# Altium schematic sheet penny.SchDoc
size A4
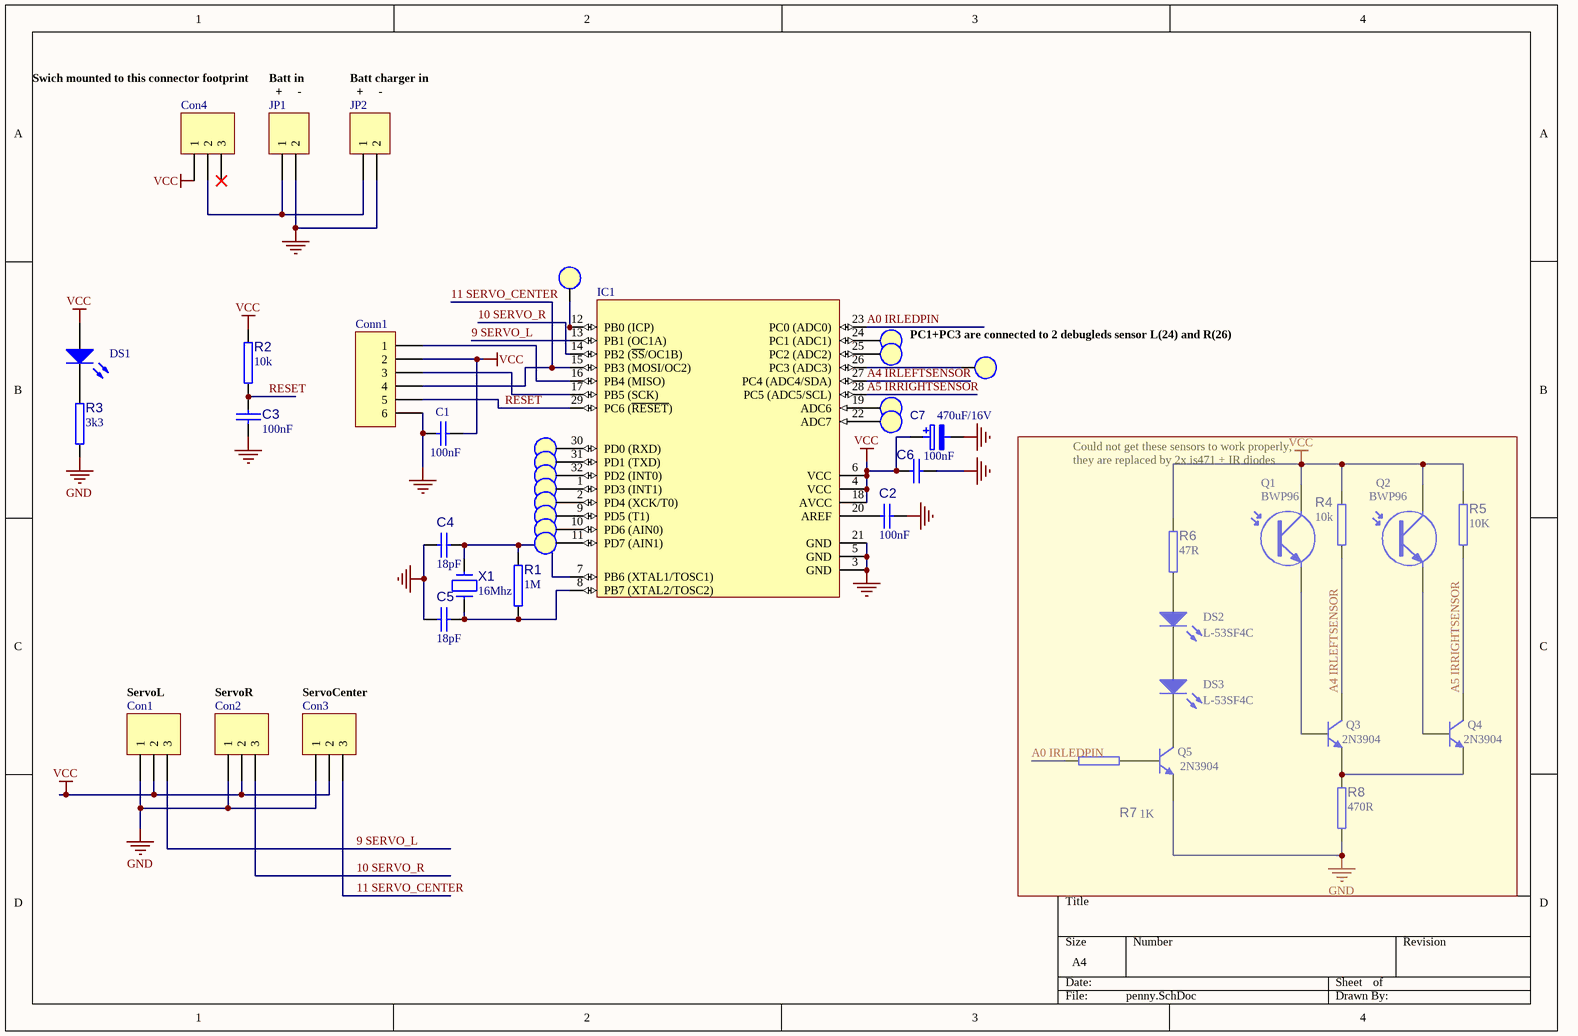
[diagram p0: penny.SchDoc]

## Parts
C1  value 100nF  [0805]
C2  value 100nF  [0805]
C3  value 100nF  [0805]
C4  value 18pF  [0805]
C5  value 18pF  [0805]
C6  value 100nF  [0805]
C7  value 470uF/16V  [RB5-10.5]
Con1  (no value)  [HDR1X3]
Con2  (no value)  [HDR1X3]
Con3  (no value)  [HDR1X3]
Con4  (no value)  [HDR1X3]
Conn1  (no value)  [HDR2X3]
DS1  (no value)  [LED-1]
DS2  value L-53SF4C  [GL480IRled]
DS3  value L-53SF4C  [GL480IRled]
IC1  (no value)  [32A]
JP1  (no value)  [HDR1X2]
JP2  (no value)  [HDR1X2]
Q1  value BWP96  [BPW96]
Q2  value BWP96  [BPW96]
Q3  value 2N3904  [BCY-W3/E4]
Q4  value 2N3904  [BCY-W3/E4]
Q5  value 2N3904  [BCY-W3/E4]
R1  value 1M  [CR2012-0805]
R2  value 10k  [0805]
R3  value 3k3  [0805]
R4  value 10k  [0805]
R5  value 10K  [0805]
R6  value 47R  [0805]
R7  value 1K  [0805]
R8  value 470R  [0805]
TP1  (no value)  [experimentpad]
TP2  (no value)  [experimentpad]
TP3  (no value)  [experimentpad]
TP4  (no value)  [experimentpad]
TP5  (no value)  [experimentpad]
TP6  (no value)  [experimentpad]
TP7  (no value)  [experimentpad]
TP8  (no value)  [experimentpad]
TP9  (no value)  [experimentpad]
TP10  (no value)  [experimentpad]
TP11  (no value)  [experimentpad]
TP12  (no value)  [experimentpad]
TP13  (no value)  [experimentpad]
TP14  (no value)  [experimentpad]
X1  value 16Mhz  [HC49/U]

## Nets
GND: C1.1 C2.2 C3.2 C4.1 C5.1 C6.2 C7.2 Con1.1 Con2.1 Con3.1 Conn1.6 IC1.3(GND) IC1.5(GND) IC1.21(GND) JP1.2 JP2.2 Q5.1(E) R3.1 R8.1
VCC: C1.2 C6.1 C7.1 Con1.2 Con2.2 Con3.2 Con4.1 Conn1.2 DS1.1(A) IC1.4(VCC) IC1.6(VCC) IC1.18(AVCC) Q1.1(C) Q2.1(C) R2.2 R4.2 R5.2 R6.2
9 SERVO_L: Con1.3 IC1.13(PB1_(OC1A))
10 SERVO_R: Con2.3 IC1.14(PB2_(~{SS}/OC1B))
11 SERVO_CENTER: Con3.3 Conn1.4 IC1.15(PB3_(MOSI/OC2))
A0 IRLEDPIN: IC1.23(PC0_(ADC0)) R7.1
A4 IRLEFTSENSOR: IC1.27(PC4_(ADC4/SDA)) Q3.3(C) R4.1
A5 IRRIGHTSENSOR: IC1.28(PC5_(ADC5/SCL)) Q4.3(C) R5.1
RESET: C3.1 Conn1.5 IC1.29(PC6_(~{RESET})) R2.1
NetC2_1: C2.1 IC1.20(AREF)
NetC4_2: C4.2 IC1.7(PB6_(XTAL1/TOSC1)) R1.2 X1.2
NetC5_2: C5.2 IC1.8(PB7_(XTAL2/TOSC2)) R1.1 X1.1
NetCon4_2: Con4.2 JP1.1 JP2.1
NetConn1_1: Conn1.1 IC1.16(PB4_(MISO))
NetConn1_3: Conn1.3 IC1.17(PB5_(SCK))
NetDS1_2: DS1.2(K) R3.2
NetDS2_1: DS2.1(K) DS3.2(A)
NetDS2_2: DS2.2(A) R6.1
NetDS3_1: DS3.1(K) Q5.3(C)
NetIC1_1: IC1.1(PD3_(INT1)) TP10.1
NetIC1_2: IC1.2(PD4_(XCK/T0)) TP11.1
NetIC1_9: IC1.9(PD5_(T1)) TP12.1
NetIC1_10: IC1.10(PD6_(AIN0)) TP13.1
NetIC1_11: IC1.11(PD7_(AIN1)) TP14.1
NetIC1_12: IC1.12(PB0_(ICP)) TP2.1
NetIC1_19: IC1.19(ADC6) TP6.1
NetIC1_22: IC1.22(ADC7) TP7.1
NetIC1_24: IC1.24(PC1_(ADC1)) TP3.1
NetIC1_25: IC1.25(PC2_(ADC2)) TP4.1
NetIC1_26: IC1.26(PC3_(ADC3)) TP5.1
NetIC1_30: IC1.30(PD0_(RXD)) TP1.1
NetIC1_31: IC1.31(PD1_(TXD)) TP8.1
NetIC1_32: IC1.32(PD2_(INT0)) TP9.1
NetQ1_3: Q1.3(E) Q3.2(B)
NetQ2_3: Q2.3(E) Q4.2(B)
NetQ3_1: Q3.1(E) Q4.1(E) R8.2
NetQ5_2: Q5.2(B) R7.2

Not connected (* = marked no-connect by the designer): Con4 3*

## Notes on the sheet
- Swich mounted to this connector footprint
- Batt in
- +     -
- Batt charger in
- PC1+PC3 are connected to 2 debugleds sensor L(24) and R(26)
- ServoL
- ServoR
- ServoCenter
- Could not get these sensors to work properly,
  they are replaced by 2x is471 + IR diodes

## Library data of the parts
C1 = CAP: capacitor nonpolar
C2 C3 C6 = CAP 100nF: capacitor nonpolar
C4 C5 = CAP18pF: capacitor nonpolar; Ordercode: C0805C180J5GAC; Supplier: KEMET; Farnell: 1414673
C7 = Elco low ESR: Part Field 1: Panasonic; Part Field 2: EEUFM1E471L; Farnell: 1219470
Con1-Con3 = Header 3: Header, 3-Pin; Value: 3pin servo connector; Revision: 17-Jul-2002: Re-released for DXP Platform.; Publisher: Altium Limited
Con4 = Header 3: Header, 3-Pin; Value: Switch footprint; Revision: 17-Jul-2002: Re-released for DXP Platform.; Publisher: Altium Limited
Conn1 = Header 6: Header, 6-Pin; Value: 2x3 boxed header; Revision: 17-Jul-2002: Re-released for DXP Platform.; Publisher: Altium Limited
DS1 = LED1: Typical RED GaAs LED; Value: 5mm LED; Published: 8-Jun-2000; Revision: July-2002: Re-released for DXP Platform.; Publisher: Altium Limited
DS2 DS3 = IR led: Typical INFRARED GaAs LED; Manufacturer: Vishay; Revision: July-2002: Re-released for DXP Platform.; Farnell: 9707794
IC1 = ATmega8A-AU: 8-Bit AVR Microcontroller with 8K Bytes of In-System Programmable Flash Memory; Package Information: Latest Revision: revB, Oct-2001; Code - JEDEC: MS-026-ABA; Value: Atmega8-AU; Published: 17-Sep-2003; Datasheet: Latest Revision: 2486H-AVR-09/02; Package Reference: 32A; Publisher: Altium Limited
JP1 JP2 = Header 2: Header, 2-Pin; Value: 3pin header; Revision: 17-Jul-2002: Re-released for DXP Platform.; Publisher: Altium Limited
Q1 Q2 = Photo NPN: NPN Phototransistor; Code - JEDEC: TO-220-AC; Published: 24-Mar-1999; Revision: July-2002: Re-released for DXP Platform.; Publisher: Altium Limited
Q3-Q5 = 2N3904: NPN General Purpose Amplifier; Revision 1: 11-Jul-2000: SIM Model Added.; Revision 2: 17-Jul-2002: Re-released for DXP Platform.; Revision 3: 15-Jan-2003: PCB Footprint 'BCY-W3/D4.7' replaced; Code - JEDEC: TO-92A; Published: 8-Jun-2000; Datasheet: Latest Revision: 1997; Package Reference: TO-92A; Publisher: Altium Limited
R1 = Res 0805
R2 R4 = Res 0805 10k: Farnell: 9333720
R3 = Res 0805 3k3: Farnell: 9334360
R5 = RES 10K: 0805 resistor; Manufacturer: Phycomp; Ordercode: 232273061103; FARNELL: 9234136; Rohs: Y; Shape: 0805; Supplier: Farnell/RS
R6 = Res 0805 47R: Farnell: 9334564
R7 = Res 0805 1k: Farnell: 9333711
R8 = Res 0805 47R: Res 0805 470R
TP1-TP14 = TESTPOINT_1: experimentpin; value: TP clip; PbFree: Yes; Shape: Leaded; Publisher: GTa
X1 = CRYSTAL 8Mhz: Shape: HC49; Rohs: Y; Supplier: Farnell/RS